# EAGLE schematic khanh_PB_ip5306_1.0 (EAGLE 6.6.0)
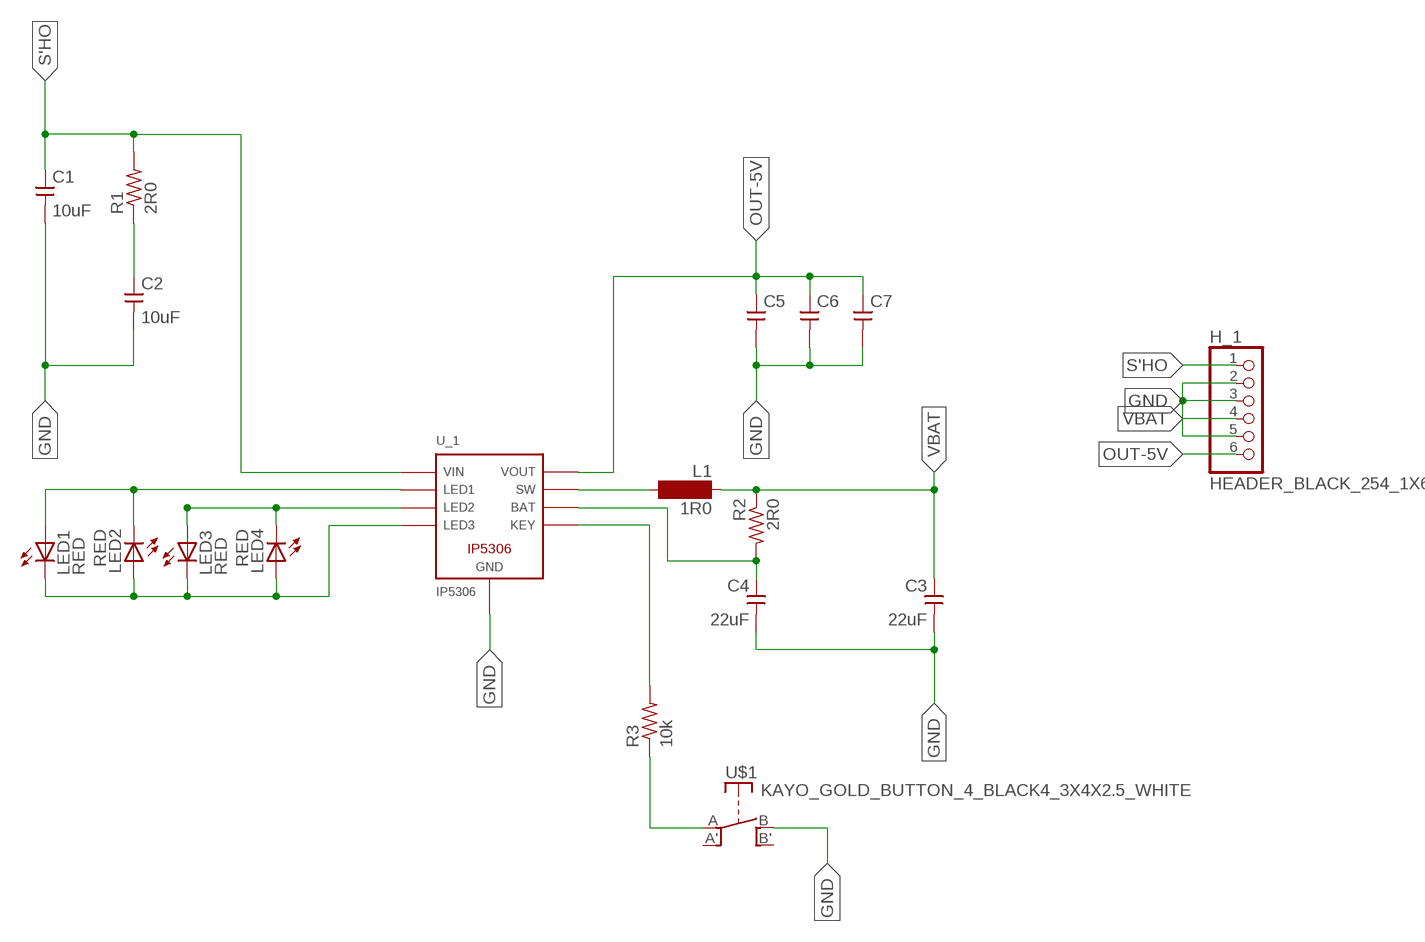
[diagram p0: schematic, sheet 1]

## Parts
C1  10uF  KAYO_CAP_CERAMIC10UF_1206  [C1206]
C2  10uF  KAYO_CAP_CERAMIC10UF_1206  [C1206]
C3  22uF  KAYO_CAP_CERAMIC22UF_1206  [C1206]
C4  22uF  KAYO_CAP_CERAMIC22UF_1206  [C1206]
C5  KAYO_CAP_CERAMIC22UF_KXN_0603  [KXN_C0603]
C6  KAYO_CAP_CERAMIC22UF_KXN_0603  [KXN_C0603]
C7  KAYO_CAP_CERAMIC22UF_KXN_0603  [KXN_C0603]
H_1  HEADER_BLACK_254_1X6  KXN_HEADER_1X6  [HEADER_1X6_254]
L1  1R0  INDUCTOR_FEEDER_KAYO_0650  [CKST_0603_0630_PACK]
LED1  RED  KAYO_LED_RED_KXN_LED_0603  [KXN_LED_0603]
LED2  RED  KAYO_LED_RED_KXN_LED_0603  [KXN_LED_0603]
LED3  RED  KAYO_LED_RED_KXN_LED_0603  [KXN_LED_0603]
LED4  RED  KAYO_LED_RED_KXN_LED_0603  [KXN_LED_0603]
R1  2R0  R-US_R0603  [R0603]
R2  2R0  R-US_R0603  [R0603]
R3  10k  R-US_R0603  [R0603]
U$1  KAYO_GOLD_BUTTON_4_BLACK4_3X4X2.5_WHITE  [KXN_BUTTON_3_4_2.5MM]
U_1  IP5306  IP5306_1  [ESOP8]

## Nets
BAT: C4.1(+) R2.2 U_1.6
GND: C1.2(-) C2.2(-) C3.2(-) C4.2(-) C5.2(-) C6.2(-) C7.2(-) H_1.2 H_1.3 H_1.5 U$1.B U_1.9
N$1: C2.1(+) R1.1
N$2: R3.1 U$1.A
N$4: L1.P$2 U_1.7
N$5: R3.2 U_1.5
N$6: LED1.A LED2.C U_1.2
N$7: LED1.C LED2.A LED3.C LED4.A U_1.4
N$8: LED3.A LED4.C U_1.3
OUT-5V: C5.1(+) C6.1(+) C7.1(+) H_1.6 U_1.8
S'HO: C1.1(+) H_1.1 R1.2 U_1.1
VBAT: C3.1(+) H_1.4 L1.P$1 R2.1
Unconnected: U$1.A' U$1.B'

## Library data of the parts
C1 C2 = kxnStandard_capacitor:KAYO_CAP_CERAMIC; CC_SHOP: CongCo; INFO: C1206 10uF 25V
C3 C4 = kxnStandard_capacitor:KAYO_CAP_CERAMIC; CC_SHOP: CongCo; INFO: C1206 22uF 25V
C5-C7 = kxnStandard_capacitor:KAYO_CAP_CERAMIC; CC_SHOP: CongCo; INFO: C0603 22uF 10V
H_1 = kxnStandard_connector:KXN_HEADER_1X6; CC_SHOP: CongCo
L1 = kxnStandard_inductor:INDUCTOR_FEEDER_KAYO: INDUCTOR SMD power inductor size: 4.6 x 4.1 x 2 (mm) https://item.taobao.com/item.htm?spm=a1z10.3-c-s.w4002-21223910208.37.43076a4bKJhobU&id=528437837997
LED1-LED4 = kxnStandard_led:KAYO_LED: LED OSRAM: - CHIPLED LG R971, LG N971, LY N971, LG Q971, LY Q971, LO R971, LY R971 LH N974, LH R974 LS Q976, LO Q976, LY Q976 LO Q996 - Hyper CHIPLED LW Q18S LB Q993, LB Q99A, LB R99A - SideLED LS A670, LO A670, LY A670, LG A670, LP A670 LB A673, LV A673, LT A673, LW A673 LH A674 LY A675 LS A676, LA A676, LO A676, LY A676, LW A676 LS A679, LY A679, LG A679 - Hyper Micro SIDELED® LS Y876, LA Y876, LO Y876, LY Y876 LT Y87S - SmartLED LW L88C, LW L88S LB L89C, LB L89S, LG L890 LS L89K, LO L89K, LY L89K LS L896, LA L896, LO L896, LY L896 - TOPLED LS T670, LO T670, LY T670, LG T670, LP T670 LSG T670, LSP T670, LSY T670, LOP T670, LYG T670 LG T671, LOG T671, LSG T671 LB T673, LV T673, LT T673, LW T673 LH T674 LS T676, LA T676, LO T676, LY T676, LB T676, LH T676, LSB T676, LW T676 LB T67C, LV T67C, LT T67C, LS T67K, LO T67K, LY T67K, LW E67C LS E67B, LA E67B, LO E67B, LY E67B, LB E67C, LV E67C, LT E67C LW T67C LS T679, LY T679, LG T679 LS T770, LO T770, LY T770, LG T770, LP T770 LB T773, LV T773, LT T773, LW T773 LH T774 LS E675, LA E675, LY E675, LS T675 LS T776, LA T776, LO T776, LY T776, LB T776 LHGB T686 LT T68C, LB T68C - Hyper Mini TOPLED® LB M676 - Mini TOPLED Santana® LG M470 LS M47K, LO M47K, LY M47K Source: http://www.osram.convergy.de/; CC_COST: 0.025; CC_ID: 522554271548; CC_LINK: https://item.taobao.com/item.htm?id=522554271548&skuId=5766142345185; CC_OPTION: 0603_红色(20只); CC_SHOP: CongCo; INFO: Led 0603 RED; JLC_PART_COST: 0.0056; JLC_PART_ID: C2286; JLC_PART_LINK: https://jlcpcb.com/partdetail/Hubei_KentoElec-KT0603R/C2286; KXN_ID: SA12131249
R1-R3 = kxnStandard_resistor:R-US_: RESISTOR, American symbol; CC_SHOP: CongCo
U$1 = kxn_Standard_button_switch:KAYO_GOLD_BUTTON_4*4: Button size: 4*4*1.5 or 4*4*3 item.htm?id=557115198331 https://jlcpcb.com/partdetail/Alpsalpine-SKRPABE010/C115360 Button_3x4x2.5mm_SKRPABE010_datasheet.pdf; INFO: BUTTON 4P SMD 3*4*2.5
U_1 = kxnStandard_IC_Function:IP5306; CC_SHOP: CongCo